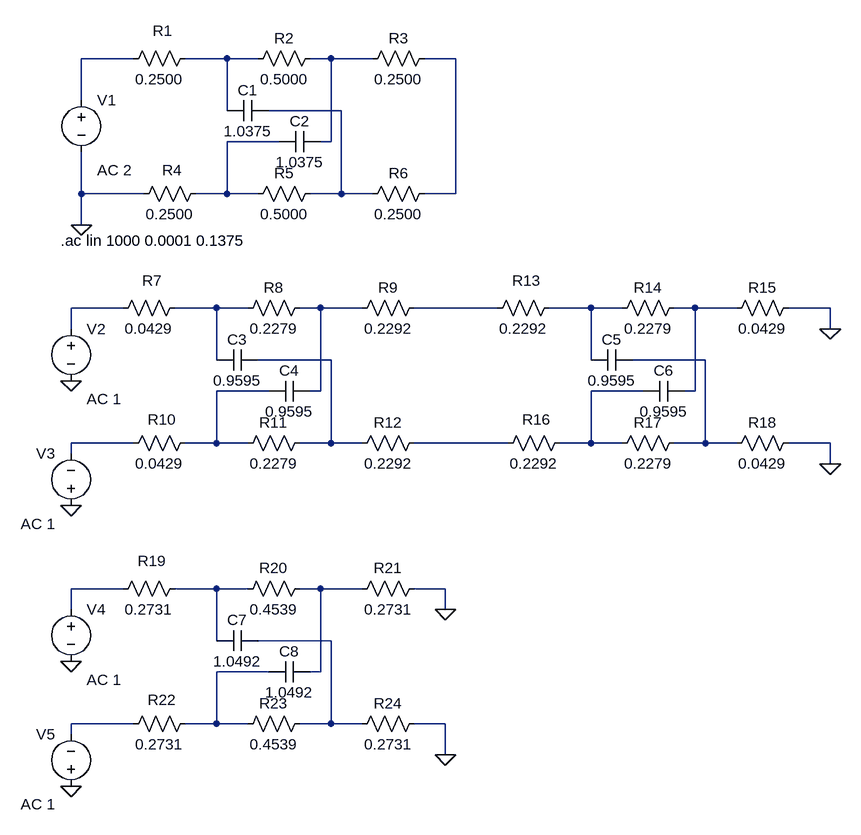
[diagram p0: schematic 1x_2xRC_lattice.asc]
1x_2xRC_lattice.asc, the LTspice schematic file:
Version 4
SHEET 1 1140 1276
WIRE 48 112 -32 112
WIRE 192 112 128 112
WIRE 240 112 192 112
WIRE 352 112 320 112
WIRE 416 112 352 112
WIRE 544 112 496 112
WIRE -32 176 -32 112
WIRE 192 192 192 112
WIRE 368 192 256 192
WIRE 272 240 192 240
WIRE 352 240 352 112
WIRE 352 240 336 240
WIRE -32 320 -32 256
WIRE 64 320 -32 320
WIRE 192 320 192 240
WIRE 192 320 144 320
WIRE 240 320 192 320
WIRE 368 320 368 192
WIRE 368 320 320 320
WIRE 416 320 368 320
WIRE 544 320 544 112
WIRE 544 320 496 320
WIRE -32 368 -32 320
WIRE 32 496 -48 496
WIRE 176 496 112 496
WIRE 224 496 176 496
WIRE 336 496 304 496
WIRE 400 496 336 496
WIRE 608 496 480 496
WIRE 752 496 688 496
WIRE 800 496 752 496
WIRE 912 496 880 496
WIRE 976 496 912 496
WIRE 1120 496 1056 496
WIRE -48 528 -48 496
WIRE 1120 528 1120 496
WIRE 176 576 176 496
WIRE 352 576 240 576
WIRE 752 576 752 496
WIRE 928 576 816 576
WIRE 256 624 176 624
WIRE 336 624 336 496
WIRE 336 624 320 624
WIRE 832 624 752 624
WIRE 912 624 912 496
WIRE 912 624 896 624
WIRE 48 704 -48 704
WIRE 176 704 176 624
WIRE 176 704 128 704
WIRE 224 704 176 704
WIRE 352 704 352 576
WIRE 352 704 304 704
WIRE 400 704 352 704
WIRE 624 704 480 704
WIRE 752 704 752 624
WIRE 752 704 704 704
WIRE 800 704 752 704
WIRE 928 704 928 576
WIRE 928 704 880 704
WIRE 976 704 928 704
WIRE 1120 704 1056 704
WIRE -48 720 -48 704
WIRE 1120 736 1120 704
WIRE 32 928 -48 928
WIRE 176 928 112 928
WIRE 224 928 176 928
WIRE 336 928 304 928
WIRE 400 928 336 928
WIRE 528 928 480 928
WIRE -48 960 -48 928
WIRE 528 960 528 928
WIRE 176 1008 176 928
WIRE 352 1008 240 1008
WIRE 256 1056 176 1056
WIRE 336 1056 336 928
WIRE 336 1056 320 1056
WIRE 48 1136 -48 1136
WIRE 176 1136 176 1056
WIRE 176 1136 128 1136
WIRE 224 1136 176 1136
WIRE 352 1136 352 1008
WIRE 352 1136 304 1136
WIRE 400 1136 352 1136
WIRE 528 1136 480 1136
WIRE -48 1152 -48 1136
WIRE 528 1184 528 1136
FLAG -32 368 0
FLAG -48 608 0
FLAG -48 800 0
FLAG 1120 528 0
FLAG 1120 736 0
FLAG -48 1040 0
FLAG -48 1232 0
FLAG 528 960 0
FLAG 528 1184 0
SYMBOL res 144 96 R90
WINDOW 0 -11 51 VBottom 2
WINDOW 3 32 56 VTop 2
SYMATTR InstName R1
SYMATTR Value 0.2500
SYMBOL res 336 96 R90
WINDOW 0 0 56 VBottom 2
WINDOW 3 32 56 VTop 2
SYMATTR InstName R2
SYMATTR Value 0.5000
SYMBOL res 512 96 R90
WINDOW 0 0 56 VBottom 2
WINDOW 3 32 56 VTop 2
SYMATTR InstName R3
SYMATTR Value 0.2500
SYMBOL res 160 304 R90
WINDOW 0 -5 52 VBottom 2
WINDOW 3 32 56 VTop 2
SYMATTR InstName R4
SYMATTR Value 0.2500
SYMBOL res 336 304 R90
WINDOW 0 0 56 VBottom 2
WINDOW 3 32 56 VTop 2
SYMATTR InstName R5
SYMATTR Value 0.5000
SYMBOL res 512 304 R90
WINDOW 0 0 56 VBottom 2
WINDOW 3 32 56 VTop 2
SYMATTR InstName R6
SYMATTR Value 0.2500
SYMBOL cap 256 176 R90
WINDOW 0 0 32 VBottom 2
WINDOW 3 32 32 VTop 2
SYMATTR InstName C1
SYMATTR Value 1.0375
SYMBOL cap 336 224 R90
WINDOW 0 0 32 VBottom 2
WINDOW 3 32 32 VTop 2
SYMATTR InstName C2
SYMATTR Value 1.0375
SYMBOL voltage -32 160 R0
WINDOW 123 24 124 Left 2
WINDOW 39 0 0 Left 0
SYMATTR Value2 AC 2
SYMATTR InstName V1
SYMATTR Value ""
SYMBOL res 128 480 R90
WINDOW 0 -11 51 VBottom 2
WINDOW 3 32 56 VTop 2
SYMATTR InstName R7
SYMATTR Value 0.0429
SYMBOL res 320 480 R90
WINDOW 0 0 56 VBottom 2
WINDOW 3 32 56 VTop 2
SYMATTR InstName R8
SYMATTR Value 0.2279
SYMBOL res 496 480 R90
WINDOW 0 0 56 VBottom 2
WINDOW 3 32 56 VTop 2
SYMATTR InstName R9
SYMATTR Value 0.2292
SYMBOL res 144 688 R90
WINDOW 0 -5 52 VBottom 2
WINDOW 3 32 56 VTop 2
SYMATTR InstName R10
SYMATTR Value 0.0429
SYMBOL res 320 688 R90
WINDOW 0 0 56 VBottom 2
WINDOW 3 32 56 VTop 2
SYMATTR InstName R11
SYMATTR Value 0.2279
SYMBOL res 496 688 R90
WINDOW 0 0 56 VBottom 2
WINDOW 3 32 56 VTop 2
SYMATTR InstName R12
SYMATTR Value 0.2292
SYMBOL cap 240 560 R90
WINDOW 0 0 32 VBottom 2
WINDOW 3 32 32 VTop 2
SYMATTR InstName C3
SYMATTR Value 0.9595
SYMBOL cap 320 608 R90
WINDOW 0 0 32 VBottom 2
WINDOW 3 32 32 VTop 2
SYMATTR InstName C4
SYMATTR Value 0.9595
SYMBOL voltage -48 512 R0
WINDOW 123 24 124 Left 2
WINDOW 39 0 0 Left 0
SYMATTR Value2 AC 1
SYMATTR InstName V2
SYMATTR Value ""
SYMBOL voltage -48 816 R180
WINDOW 0 24 96 Left 2
WINDOW 3 24 16 Left 2
WINDOW 123 24 -12 Left 2
WINDOW 39 0 0 Left 0
SYMATTR InstName V3
SYMATTR Value ""
SYMATTR Value2 AC 1
SYMBOL res 704 480 R90
WINDOW 0 -11 51 VBottom 2
WINDOW 3 32 56 VTop 2
SYMATTR InstName R13
SYMATTR Value 0.2292
SYMBOL res 896 480 R90
WINDOW 0 0 56 VBottom 2
WINDOW 3 32 56 VTop 2
SYMATTR InstName R14
SYMATTR Value 0.2279
SYMBOL res 1072 480 R90
WINDOW 0 0 56 VBottom 2
WINDOW 3 32 56 VTop 2
SYMATTR InstName R15
SYMATTR Value 0.0429
SYMBOL res 720 688 R90
WINDOW 0 -5 52 VBottom 2
WINDOW 3 32 56 VTop 2
SYMATTR InstName R16
SYMATTR Value 0.2292
SYMBOL res 896 688 R90
WINDOW 0 0 56 VBottom 2
WINDOW 3 32 56 VTop 2
SYMATTR InstName R17
SYMATTR Value 0.2279
SYMBOL res 1072 688 R90
WINDOW 0 0 56 VBottom 2
WINDOW 3 32 56 VTop 2
SYMATTR InstName R18
SYMATTR Value 0.0429
SYMBOL cap 816 560 R90
WINDOW 0 0 32 VBottom 2
WINDOW 3 32 32 VTop 2
SYMATTR InstName C5
SYMATTR Value 0.9595
SYMBOL cap 896 608 R90
WINDOW 0 0 32 VBottom 2
WINDOW 3 32 32 VTop 2
SYMATTR InstName C6
SYMATTR Value 0.9595
SYMBOL res 128 912 R90
WINDOW 0 -11 51 VBottom 2
WINDOW 3 32 56 VTop 2
SYMATTR InstName R19
SYMATTR Value 0.2731
SYMBOL res 320 912 R90
WINDOW 0 0 56 VBottom 2
WINDOW 3 32 56 VTop 2
SYMATTR InstName R20
SYMATTR Value 0.4539
SYMBOL res 496 912 R90
WINDOW 0 0 56 VBottom 2
WINDOW 3 32 56 VTop 2
SYMATTR InstName R21
SYMATTR Value 0.2731
SYMBOL res 144 1120 R90
WINDOW 0 -5 52 VBottom 2
WINDOW 3 32 56 VTop 2
SYMATTR InstName R22
SYMATTR Value 0.2731
SYMBOL res 320 1120 R90
WINDOW 0 0 56 VBottom 2
WINDOW 3 32 56 VTop 2
SYMATTR InstName R23
SYMATTR Value 0.4539
SYMBOL res 496 1120 R90
WINDOW 0 0 56 VBottom 2
WINDOW 3 32 56 VTop 2
SYMATTR InstName R24
SYMATTR Value 0.2731
SYMBOL cap 240 992 R90
WINDOW 0 0 32 VBottom 2
WINDOW 3 32 32 VTop 2
SYMATTR InstName C7
SYMATTR Value 1.0492
SYMBOL cap 320 1040 R90
WINDOW 0 0 32 VBottom 2
WINDOW 3 32 32 VTop 2
SYMATTR InstName C8
SYMATTR Value 1.0492
SYMBOL voltage -48 944 R0
WINDOW 123 24 124 Left 2
WINDOW 39 0 0 Left 0
SYMATTR Value2 AC 1
SYMATTR InstName V4
SYMATTR Value ""
SYMBOL voltage -48 1248 R180
WINDOW 0 24 96 Left 2
WINDOW 3 24 16 Left 2
WINDOW 123 24 -12 Left 2
WINDOW 39 0 0 Left 0
SYMATTR InstName V5
SYMATTR Value ""
SYMATTR Value2 AC 1
TEXT -64 392 Left 2 !.ac lin 1000 0.0001 0.1375

The netlist it stands for:
* 1x_2xRC_lattice.asc
R1 N002 N001 0.2500
R2 N003 N002 0.5000
R3 N004 N003 0.2500
R4 N006 0 0.2500
R5 N005 N006 0.5000
R6 N004 N005 0.2500
C1 N005 N002 1.0375
C2 N003 N006 1.0375
V1 N001 0 AC 2
R7 N008 N007 0.0429
R8 N009 N008 0.2279
R9 N010 N009 0.2292
R10 N015 N017 0.0429
R11 N013 N015 0.2279
R12 N018 N013 0.2292
C3 N013 N008 0.9595
C4 N009 N015 0.9595
V2 N007 0 AC 1
V3 0 N017 AC 1
R13 N011 N010 0.2292
R14 N012 N011 0.2279
R15 0 N012 0.0429
R16 N016 N018 0.2292
R17 N014 N016 0.2279
R18 0 N014 0.0429
C5 N014 N011 0.9595
C6 N012 N016 0.9595
R19 N020 N019 0.2731
R20 N021 N020 0.4539
R21 0 N021 0.2731
R22 N023 N024 0.2731
R23 N022 N023 0.4539
R24 0 N022 0.2731
C7 N022 N020 1.0492
C8 N021 N023 1.0492
V4 N019 0 AC 1
V5 0 N024 AC 1
.ac lin 1000 0.0001 0.1375
.backanno
.end